# Altium schematic sheet USB.SchDoc
size 431 x 254 mm
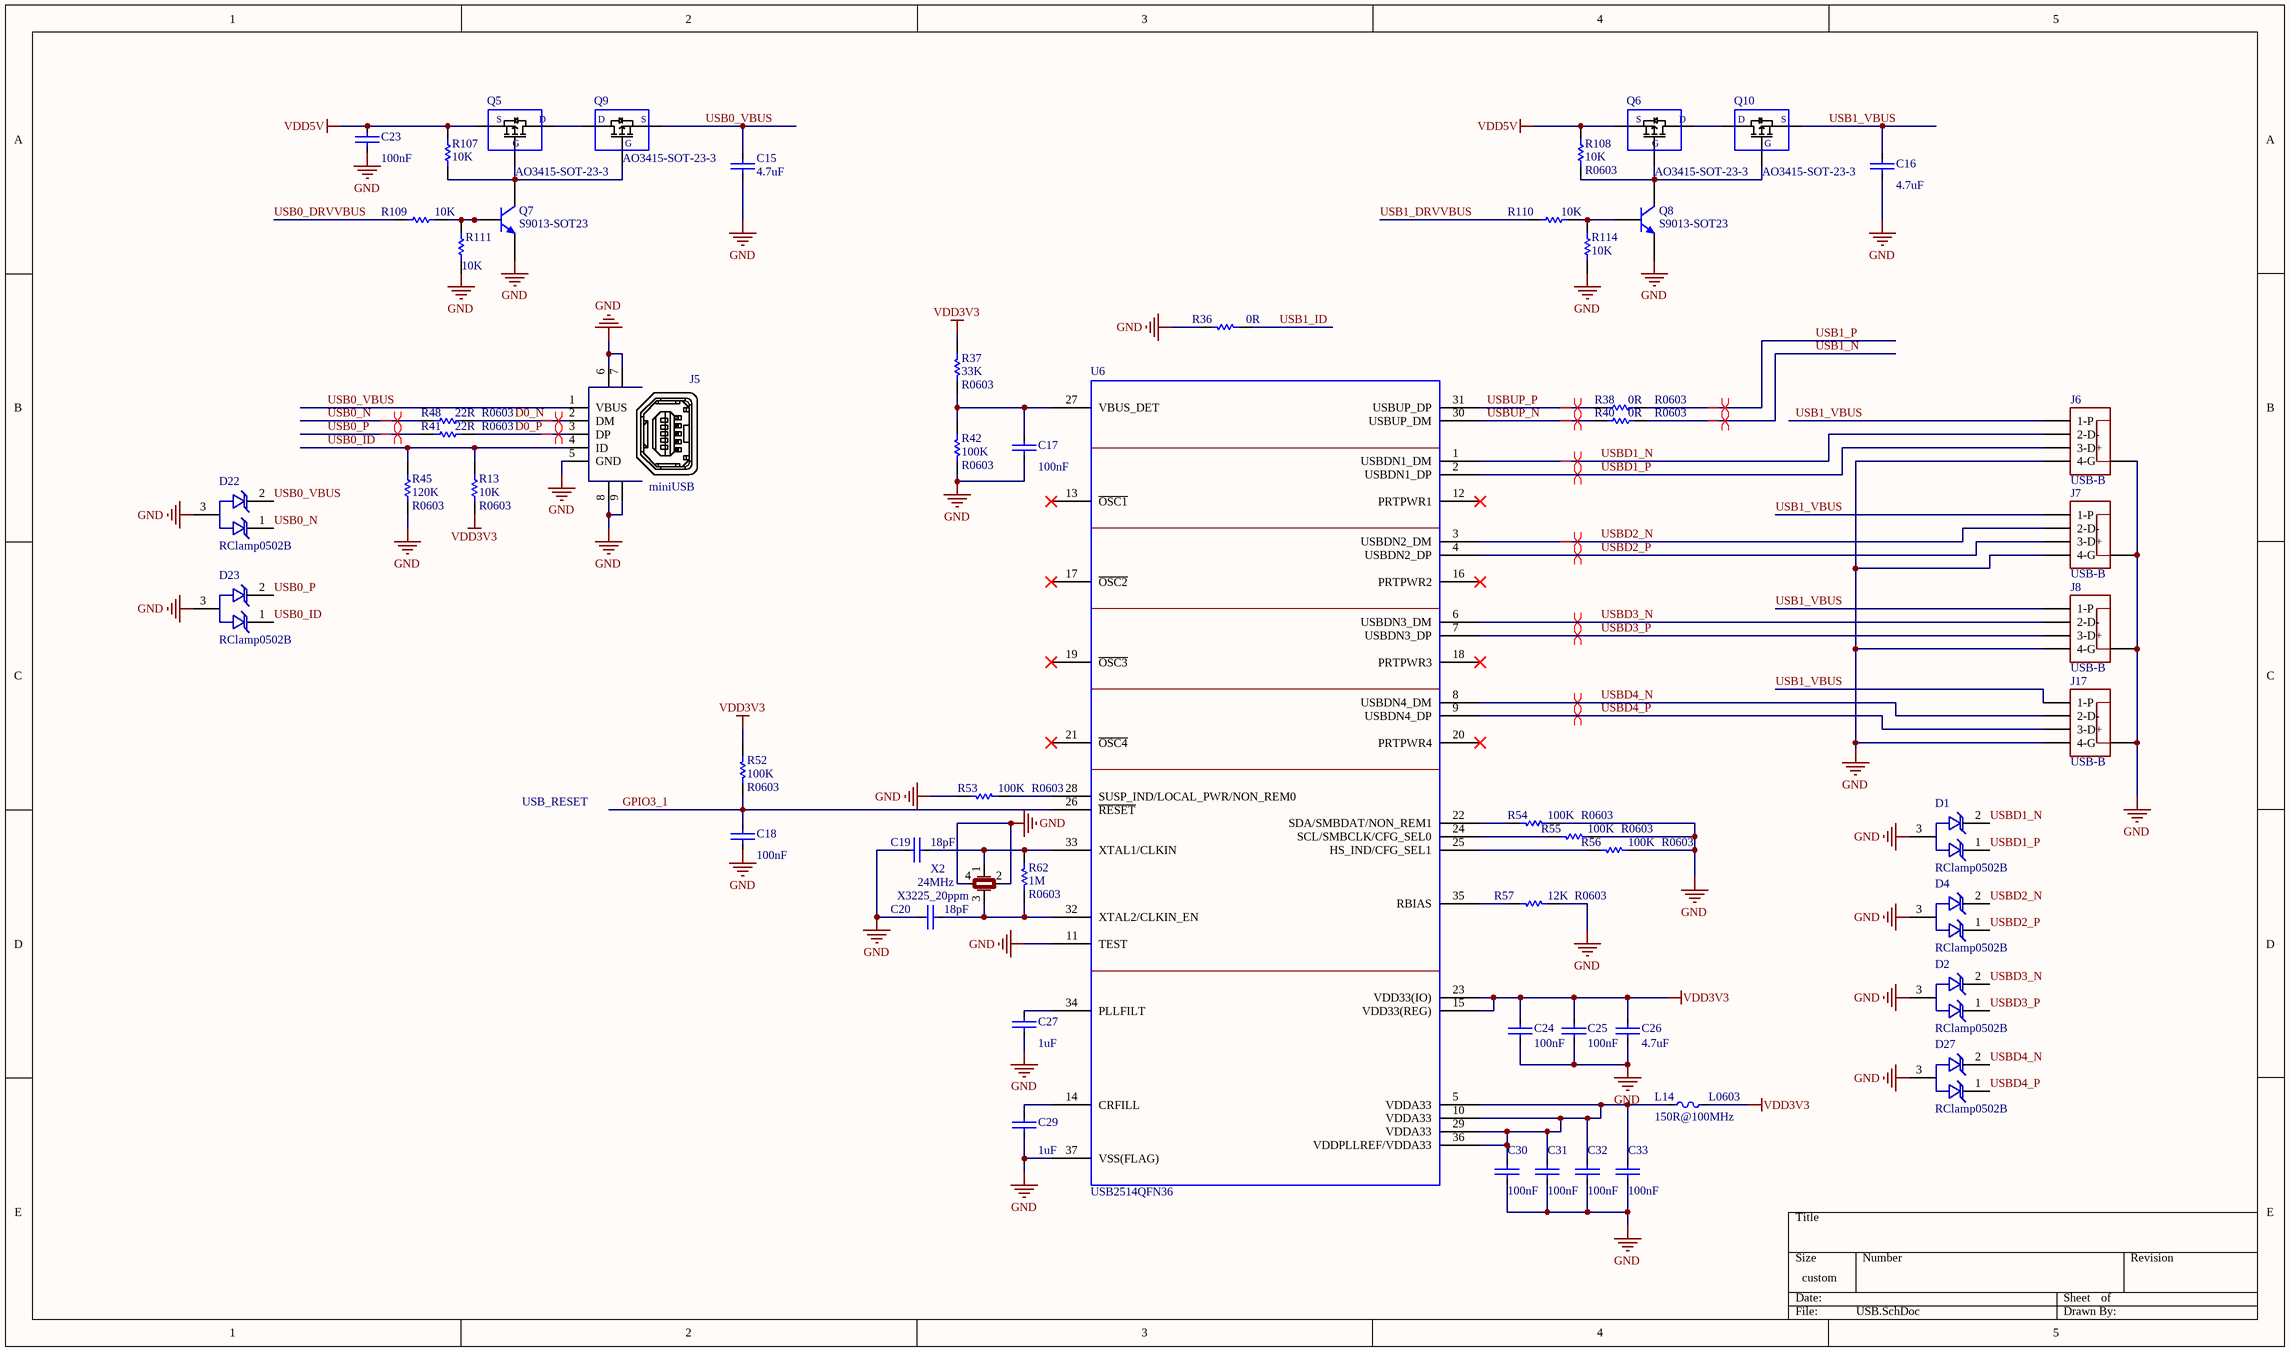
[diagram p0: USB.SchDoc]

## Parts
C15  4.7uF  [C0603_M1608]
C16  4.7uF  [C0603_M1608]
C17  100nF  [C0603_M1608]
C18  100nF  [C0603_M1608]
C19  18pF  [C0603_M1608]
C20  18pF  [C0603_M1608]
C23  100nF  [C0603_M1608]
C24  100nF  [C0603_M1608]
C25  100nF  [C0603_M1608]
C26  4.7uF  [C0603_M1608]
C27  1uF  [C0603_M1608]
C29  1uF  [C0603_M1608]
C30  100nF  [C0603_M1608]
C31  100nF  [C0603_M1608]
C32  100nF  [C0603_M1608]
C33  100nF  [C0603_M1608]
D1  value RClamp0502B  [SOT-523]  (hidden comment: LCTVS)
D2  value RClamp0502B  [SOT-523]  (hidden comment: LCTVS)
D4  value RClamp0502B  [SOT-523]  (hidden comment: LCTVS)
D22  value RClamp0502B  [SOT-523]  (hidden comment: LCTVS)
D23  value RClamp0502B  [SOT-523]  (hidden comment: LCTVS)
D27  value RClamp0502B  [SOT-523]  (hidden comment: LCTVS)
J5  miniUSB  [MiniUSB]
J6  USB-B  [USB-C]
J7  USB-B  [USB-C]
J8  USB-B  [USB-C]
J17  USB-B  [USB-C]
L14  150R@100MHz  value L0603  [L0603_M1608]
Q5  AO3415-SOT-23-3  [SOT23]
Q6  AO3415-SOT-23-3  [SOT23]
Q7  S9013-SOT23  [SOT23]
Q8  S9013-SOT23  [SOT23]
Q9  AO3415-SOT-23-3  [SOT23]
Q10  AO3415-SOT-23-3  [SOT23]
R13  10K  value R0603  [R0603_M1608]
R36  0R  [R0603_M1608]
R37  33K  value R0603  [R0603_M1608]
R38  0R  value R0603  [R0603_M1608]
R40  0R  value R0603  [R0603_M1608]
R41  22R  value R0603  [R0603_M1608]
R42  100K  value R0603  [R0603_M1608]
R45  120K  value R0603  [R0603_M1608]
R48  22R  value R0603  [R0603_M1608]
R52  100K  value R0603  [R0603_M1608]
R53  100K  value R0603  [R0603_M1608]
R54  100K  value R0603  [R0603_M1608]
R55  100K  value R0603  [R0603_M1608]
R56  100K  value R0603  [R0603_M1608]
R57  12K  value R0603  [R0603_M1608]
R62  1M  value R0603  [R0603_M1608]
R107  10K  [R0603_M1608]
R108  10K  value R0603  [R0603_M1608]
R109  10K  [R0603_M1608]
R110  10K  [R0603_M1608]
R111  10K  [R0603_M1608]
R114  10K  [R0603_M1608]
U6  USB2514QFN36  [QFN36(USB251x)]
X2  24MHz  value X3225_20ppm  [Crystals_3225]

## Nets
GND: C15.2 C16.2 C17.2 C18.1 C19.1 C20.1 C23.1 C24.2 C25.2 C26.2 C27.2 C29.2 C30.2 C31.2 C32.2 C33.2 D1.3 D2.3 D4.3 D22.3 D23.3 D27.3 J5.5(GND) J5.6 J5.7 J5.8 J5.9 J6.0 J6.4(4-G) J7.0 J7.4(4-G) J8.0 J8.4(4-G) J17.0 J17.4(4-G) Q7.2(E) Q8.2(E) R36.1 R42.1 R45.1 R53.1 R54.2 R55.2 R56.2 R57.2 R111.2 R114.2 U6.11(TEST) U6.37(VSS(FLAG)) X2.2 X2.4
VDD3V3: C24.1 C25.1 C26.1 L14.1 R13.1 R37.2 R52.2 U6.15(VDD33(REG)) U6.23(VDD33(IO))
VDD5V: C23.2 Q5.2(S) Q6.2(S) R107.2 R108.2
D0_N: J5.2(DM) R48.2
D0_P: J5.3(DP) R41.2
GPIO3_1: C18.2 R52.1 U6.26(~{RESET})
USB0_DRVVBUS: R109.2
USB0_ID: D23.1 J5.4(ID) R13.2 R45.2
USB0_N: D22.1 R48.1
USB0_P: D23.2 R41.1
USB0_VBUS: C15.1 D22.2 J5.1(VBUS) Q9.2(S)
USB1_DRVVBUS: R110.2
USB1_ID: R36.2
USB1_N: R40.2
USB1_P: R38.2
USB1_VBUS: C16.1 J6.1(1-P) J7.1(1-P) J8.1(1-P) J17.1(1-P) Q10.2(S)
USBD1_N: D1.2 J6.2(2-D-) U6.1(USBDN1_DM)
USBD1_P: D1.1 J6.3(3-D+) U6.2(USBDN1_DP)
USBD2_N: D4.2 J7.2(2-D-) U6.3(USBDN2_DM)
USBD2_P: D4.1 J7.3(3-D+) U6.4(USBDN2_DP)
USBD3_N: D2.2 J8.2(2-D-) U6.6(USBDN3_DM)
USBD3_P: D2.1 J8.3(3-D+) U6.7(USBDN3_DP)
USBD4_N: D27.2 J17.2(2-D-) U6.8(USBDN4_DM)
USBD4_P: D27.1 J17.3(3-D+) U6.9(USBDN4_DP)
USBUP_N: R40.1 U6.30(USBUP_DM)
USBUP_P: R38.1 U6.31(USBUP_DP)
NetC17_1: C17.1 R37.1 R42.2 U6.27(VBUS_DET)
NetC19_2: C19.2 R62.2 U6.33(XTAL1/CLKIN) X2.1
NetC20_2: C20.2 R62.1 U6.32(XTAL2/CLKIN_EN) X2.3
NetC27_1: C27.1 U6.34(PLLFILT)
NetC29_1: C29.1 U6.14(CRFILL)
NetC30_1: C30.1 C31.1 C32.1 C33.1 L14.2 U6.5(VDDA33) U6.10(VDDA33) U6.29(VDDA33) U6.36(VDDPLLREF/VDDA33)
NetQ5_1: Q5.1(G) Q7.3(C) Q9.1(G) R107.1
NetQ5_3: Q5.3(D) Q9.3(D)
NetQ6_1: Q6.1(G) Q8.3(C) Q10.1(G) R108.1
NetQ6_3: Q6.3(D) Q10.3(D)
NetQ7_1: Q7.1(B) R109.1 R111.1
NetQ8_1: Q8.1(B) R110.1 R114.1
NetR53_2: R53.2 U6.28(SUSP_IND/LOCAL_PWR/NON_REM0)
NetR54_1: R54.1 U6.22(SDA/SMBDAT/NON_REM1)
NetR55_1: R55.1 U6.24(SCL/SMBCLK/CFG_SEL0)
NetR56_1: R56.1 U6.25(HS_IND/CFG_SEL1)
NetR57_1: R57.1 U6.35(RBIAS)

Not connected (* = marked no-connect by the designer): U6 12(PRTPWR1)* 13(~{OSC1})* 16(PRTPWR2)* 17(~{OSC2})* 18(PRTPWR3)* 19(~{OSC3})* 20(PRTPWR4)* 21(~{OSC4})*

## Layout directives
differential pair: D0_N, D0_P, USB0_N, USB0_P, USB1_N, USB1_P, USBD1_N, USBD1_P, USBD2_N, USBD2_P, USBD3_N, USBD3_P, USBD4_N, USBD4_P, USBUP_N, USBUP_P

## Notes on the sheet
- USB_RESET

## Library data of the parts
C15-C20 C23-C27 C29-C33 = CAP_1: value: C0805
J6-J8 J17 = USB_B
L14 = BEADS: 0603
Q5 Q6 Q9 Q10 = AO3415
Q7 Q8 = S9013
R13 R36-R38 R40-R42 R45 R48 R52-R57 R62 R107-R111 R114 = Res1: R0603; Published: 8-Jun-2000; LatestRevisionDate: 17-Jul-2002; LatestRevisionNote: Re-released for DXP Platform.; PackageReference: AXIAL-0.3; Publisher: Altium Limited; PackageDescription: Axial Device, Thru-Hole; 2 Leads; 0.3 in Pin Spacing
  R36 R107 R109-R111 R114: Value: R0603
X2 = XTAL: X3225_20ppm